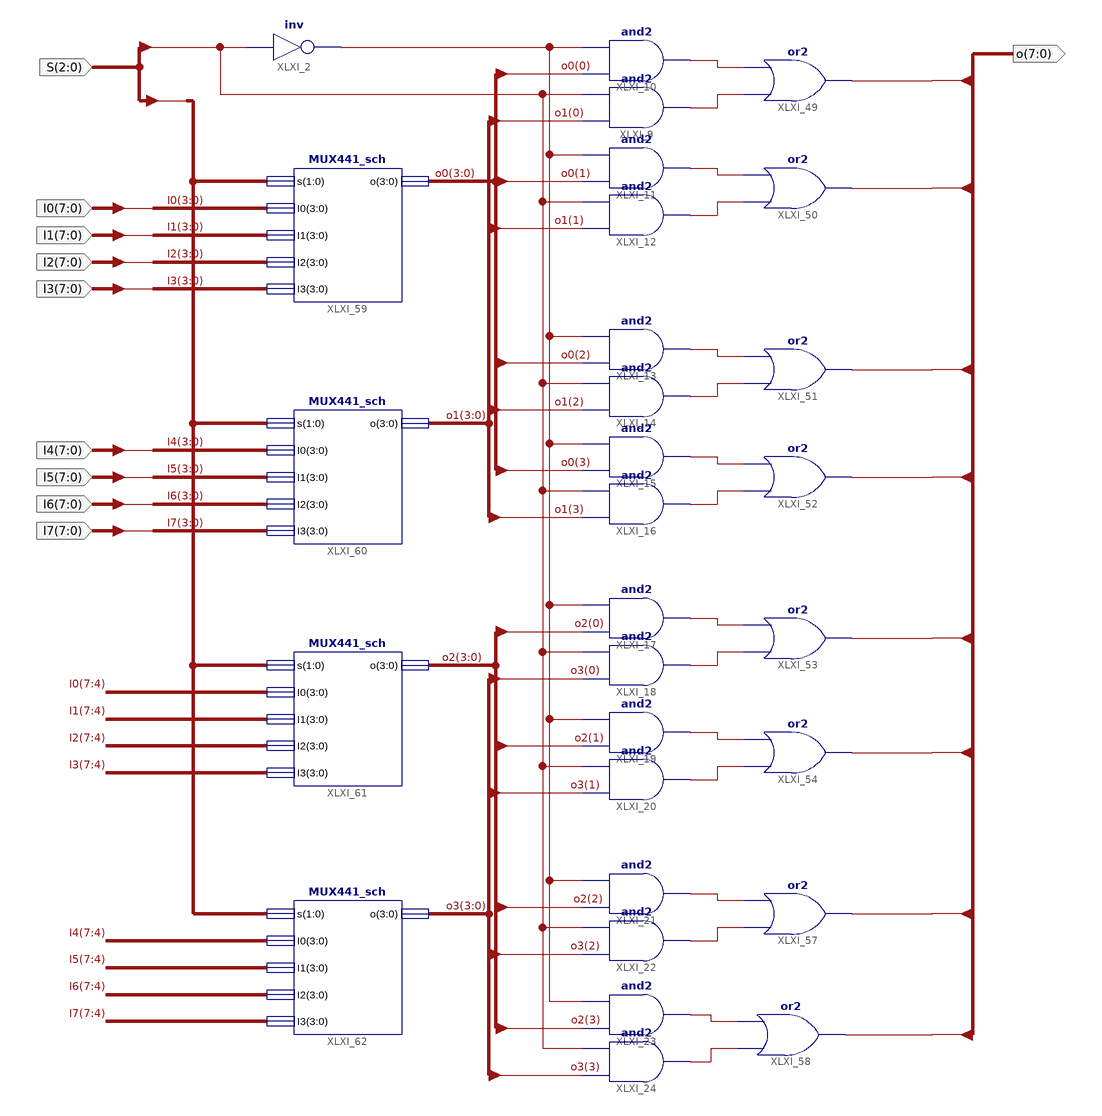
[diagram p0: schematic sheet 1]
// Xilinx ISE schematic ExMUX_sch.sch (kintex7) as structural Verilog: 29 symbols, 10 ports
module ExMUX_sch (
  input  [2:0] S,
  input  [7:0] I0,
  input  [7:0] I1,
  input  [7:0] I2,
  input  [7:0] I3,
  input  [7:0] I4,
  input  [7:0] I5,
  input  [7:0] I6,
  input  [7:0] I7,
  output [7:0] o
);

  wire XLXN_52, XLXN_53, XLXN_54, XLXN_55, XLXN_56, XLXN_57, XLXN_58, XLXN_59, XLXN_60, XLXN_61, XLXN_62,
       XLXN_64, XLXN_65, XLXN_67, XLXN_68, XLXN_69, XLXN_70;
  wire [3:0] o0, o1, o2, o3;

  not XLXI_2 (XLXN_70, S[2]);
  and XLXI_9 (XLXN_53, o1[0], S[2]);
  and XLXI_10 (XLXN_52, o0[0], XLXN_70);
  and XLXI_21 (XLXN_65, o2[2], XLXN_70);
  and XLXI_22 (XLXN_67, o3[2], S[2]);
  and XLXI_23 (XLXN_68, o2[3], XLXN_70);
  and XLXI_24 (XLXN_69, o3[3], S[2]);
  and XLXI_11 (XLXN_54, o0[1], XLXN_70);
  and XLXI_12 (XLXN_55, o1[1], S[2]);
  and XLXI_15 (XLXN_58, o0[3], XLXN_70);
  and XLXI_16 (XLXN_59, o1[3], S[2]);
  and XLXI_13 (XLXN_56, o0[2], XLXN_70);
  and XLXI_14 (XLXN_57, o1[2], S[2]);
  and XLXI_19 (XLXN_62, o2[1], XLXN_70);
  and XLXI_20 (XLXN_64, o3[1], S[2]);
  and XLXI_17 (XLXN_60, o2[0], XLXN_70);
  and XLXI_18 (XLXN_61, o3[0], S[2]);
  or XLXI_49 (o[0], XLXN_53, XLXN_52);
  or XLXI_50 (o[1], XLXN_55, XLXN_54);
  or XLXI_51 (o[2], XLXN_57, XLXN_56);
  or XLXI_52 (o[3], XLXN_59, XLXN_58);
  or XLXI_53 (o[4], XLXN_61, XLXN_60);
  or XLXI_54 (o[5], XLXN_64, XLXN_62);
  or XLXI_57 (o[6], XLXN_67, XLXN_65);
  or XLXI_58 (o[7], XLXN_69, XLXN_68);
  MUX441_sch XLXI_59 (.s(S[1:0]), .I0(I0[3:0]), .I1(I1[3:0]), .I2(I2[3:0]), .I3(I3[3:0]), .o(o0));
  MUX441_sch XLXI_60 (.s(S[1:0]), .I0(I4[3:0]), .I1(I5[3:0]), .I2(I6[3:0]), .I3(I7[3:0]), .o(o1));
  MUX441_sch XLXI_61 (.s(S[1:0]), .I0(I0[7:4]), .I1(I1[7:4]), .I2(I2[7:4]), .I3(I3[7:4]), .o(o2));
  MUX441_sch XLXI_62 (.s(S[1:0]), .I0(I4[7:4]), .I1(I5[7:4]), .I2(I6[7:4]), .I3(I7[7:4]), .o(o3));
endmodule
